# Altium schematic sheet LvlTranslate.SchDoc: Level Translators
size Letter; Author: Adam Gilbert; CompanyName: McGill University; DrawnBy: Adam Gilbert; Organization: Altium Limited; Address1: McGill Cosmology; Address2: 3600 University Street; Address3: Montreal, Quebec; Address4: Canada; Revision: Rev0; ProjectTitle: Dan DfMux Mezz; ModelNumber: MGMEZZ04; ProjectName: Dan DfMux Mezz
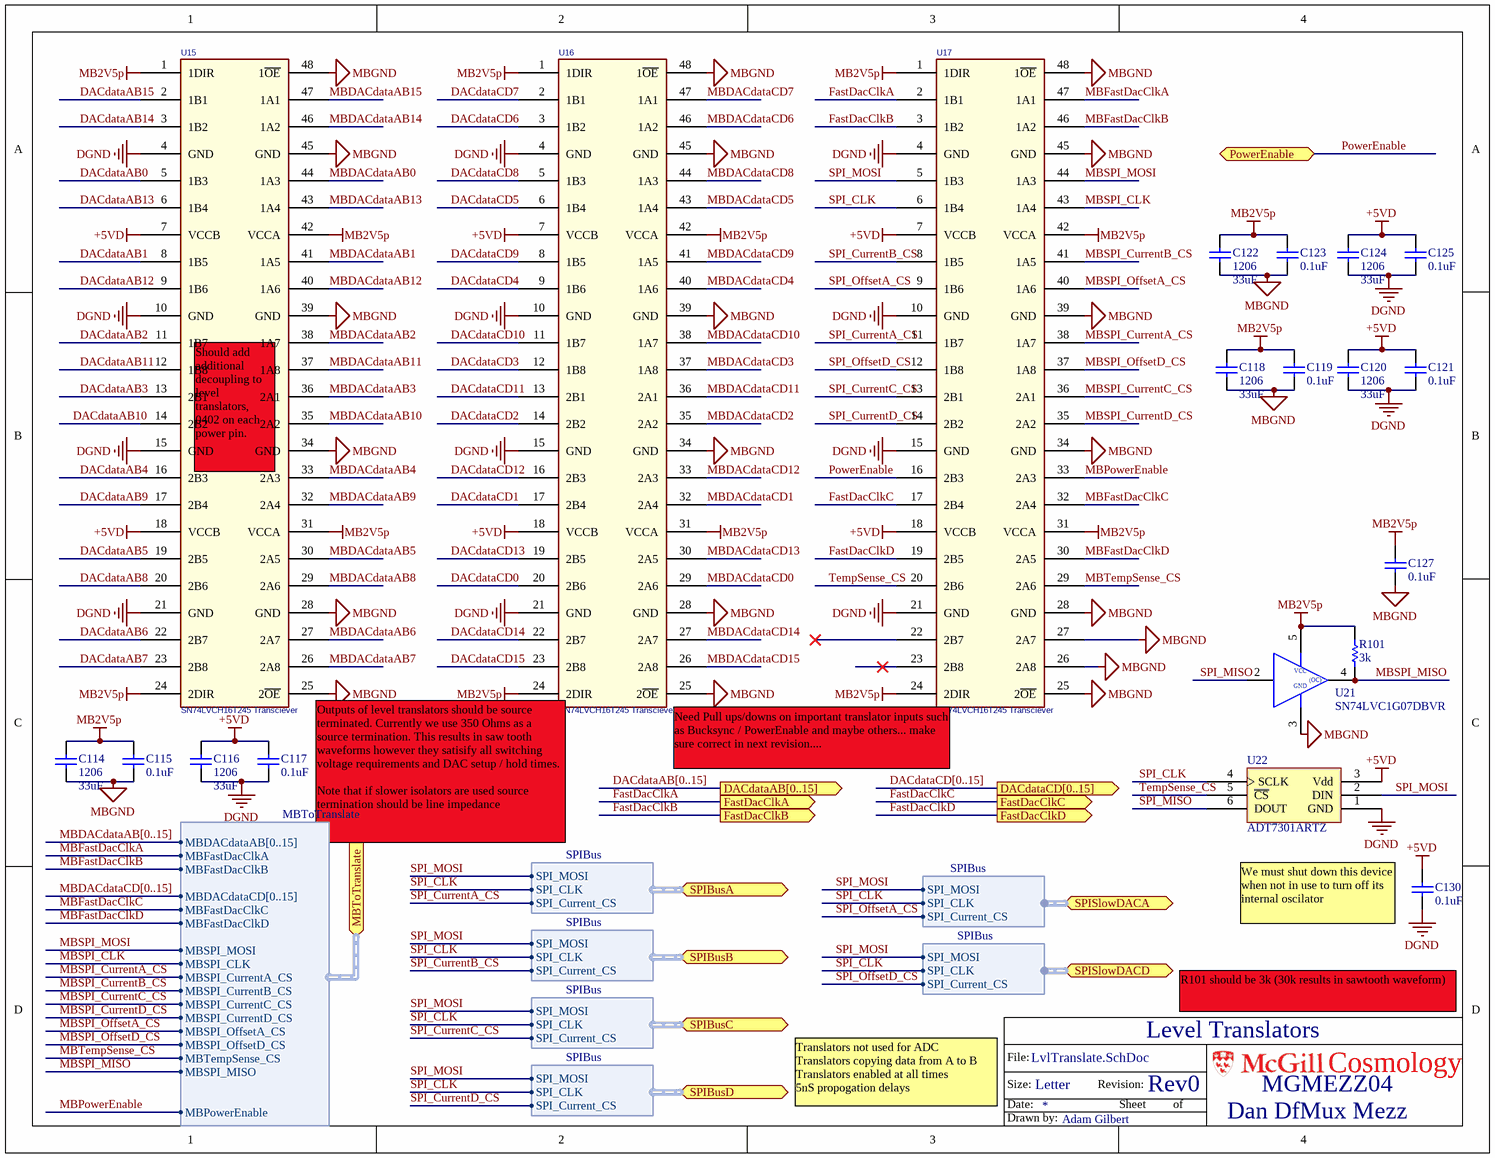
[diagram p0: LvlTranslate.SchDoc]

## Parts
C114  Footprint: 1206  [CC3225-1210]  (hidden comment: 33uF)
C115  0.1uF  [0603]
C116  Footprint: 1206  [CC3225-1210]  (hidden comment: 33uF)
C117  0.1uF  [0603]
C118  Footprint: 1206  [CC3225-1210]  (hidden comment: 33uF)
C119  0.1uF  [0603]
C120  Footprint: 1206  [CC3225-1210]  (hidden comment: 33uF)
C121  0.1uF  [0603]
C122  Footprint: 1206  [CC3225-1210]  (hidden comment: 33uF)
C123  0.1uF  [0603]
C124  Footprint: 1206  [CC3225-1210]  (hidden comment: 33uF)
C125  0.1uF  [0603]
C127  0.1uF  [0603]
C130  0.1uF  [0603]
R101  3k  [0603]
U15  SN74LVCH16T245 Transciever  [TSSOP48-0.5mmpitch]
U16  SN74LVCH16T245 Transciever  [TSSOP48-0.5mmpitch]
U17  SN74LVCH16T245 Transciever  [TSSOP48-0.5mmpitch]
U21  Manufacturers Part Number: SN74LVC1G07DBVR  [SOT23-5]  (hidden comment: 74LVC1G07)
U22  ADT7301ARTZ  [SOT23-6]

## Ports
DACdataAB[0..15] (out), DACdataCD[0..15] (out), FastDacClkA (out), FastDacClkB (out), FastDacClkC (out), FastDacClkD (out), MBToTranslate (harness MBToTranslate), PowerEnable, SPIBusA (harness SPIBus), SPIBusB (harness SPIBus), SPIBusC (harness SPIBus), SPIBusD (harness SPIBus), SPISlowDACA (harness SPIBus), SPISlowDACD (harness SPIBus)

## Harnesses
MBToTranslate: MBDACdataAB[0..15], MBFastDacClkA, MBSPI_MOSI, MBSPI_CLK, MBFastDacClkB, MBFastDacClkC, MBFastDacClkD, MBDACdataCD[0..15], MBPowerEnable, MBSPI_CurrentA_CS, MBSPI_CurrentB_CS, MBSPI_CurrentC_CS, MBSPI_CurrentD_CS, MBSPI_OffsetA_CS, MBSPI_OffsetD_CS, MBTempSense_CS, MBSPI_MISO
SPIBus: SPI_MOSI, SPI_CLK, SPI_Current_CS

## Nets
+5VD: C116.1 C117.1 C120.1 C121.1 C124.1 C125.1 C130.1 U15.7(VCCB) U15.18(VCCB) U16.7(VCCB) U16.18(VCCB) U17.7(VCCB) U17.18(VCCB) U22.3(Vdd)
DGND: C116.2 C117.2 C120.2 C121.2 C124.2 C125.2 C130.2 U15.4(GND) U15.10(GND) U15.15(GND) U15.21(GND) U16.4(GND) U16.10(GND) U16.15(GND) U16.21(GND) U17.4(GND) U17.10(GND) U17.15(GND) U17.21(GND) U22.1(GND)
MB2V5p: C114.1 C115.1 C118.1 C119.1 C122.1 C123.1 C127.1 R101.2 U15.1(1DIR) U15.24(2DIR) U15.31(VCCA) U15.42(VCCA) U16.1(1DIR) U16.24(2DIR) U16.31(VCCA) U16.42(VCCA) U17.1(1DIR) U17.24(2DIR) U17.31(VCCA) U17.42(VCCA) U21.5(Vcc)
MBGND: C114.2 C115.2 C118.2 C119.2 C122.2 C123.2 C127.2 U15.25(2~{OE}) U15.28(GND) U15.34(GND) U15.39(GND) U15.45(GND) U15.48(1~{OE}) U16.25(2~{OE}) U16.28(GND) U16.34(GND) U16.39(GND) U16.45(GND) U16.48(1~{OE}) U17.25(2~{OE}) U17.26(2A8) U17.27(2A7) U17.28(GND) U17.34(GND) U17.39(GND) U17.45(GND) U17.48(1~{OE}) U21.3(Gnd)
DACdataAB0: U15.5(1B3)
DACdataAB1: U15.8(1B5)
DACdataAB2: U15.11(1B7)
DACdataAB3: U15.13(2B1)
DACdataAB4: U15.16(2B3)
DACdataAB5: U15.19(2B5)
DACdataAB6: U15.22(2B7)
DACdataAB7: U15.23(2B8)
DACdataAB8: U15.20(2B6)
DACdataAB9: U15.17(2B4)
DACdataAB10: U15.14(2B2)
DACdataAB11: U15.12(1B8)
DACdataAB12: U15.9(1B6)
DACdataAB13: U15.6(1B4)
DACdataAB14: U15.3(1B2)
DACdataAB15: U15.2(1B1)
DACdataCD0: U16.20(2B6)
DACdataCD1: U16.17(2B4)
DACdataCD2: U16.14(2B2)
DACdataCD3: U16.12(1B8)
DACdataCD4: U16.9(1B6)
DACdataCD5: U16.6(1B4)
DACdataCD6: U16.3(1B2)
DACdataCD7: U16.2(1B1)
DACdataCD8: U16.5(1B3)
DACdataCD9: U16.8(1B5)
DACdataCD10: U16.11(1B7)
DACdataCD11: U16.13(2B1)
DACdataCD12: U16.16(2B3)
DACdataCD13: U16.19(2B5)
DACdataCD14: U16.22(2B7)
DACdataCD15: U16.23(2B8)
FastDacClkA: U17.2(1B1) ; port FastDacClkA
FastDacClkB: U17.3(1B2) ; port FastDacClkB
FastDacClkC: U17.17(2B4) ; port FastDacClkC
FastDacClkD: U17.19(2B5) ; port FastDacClkD
MBDACdataAB0: U15.44(1A3)
MBDACdataAB1: U15.41(1A5)
MBDACdataAB2: U15.38(1A7)
MBDACdataAB3: U15.36(2A1)
MBDACdataAB4: U15.33(2A3)
MBDACdataAB5: U15.30(2A5)
MBDACdataAB6: U15.27(2A7)
MBDACdataAB7: U15.26(2A8)
MBDACdataAB8: U15.29(2A6)
MBDACdataAB9: U15.32(2A4)
MBDACdataAB10: U15.35(2A2)
MBDACdataAB11: U15.37(1A8)
MBDACdataAB12: U15.40(1A6)
MBDACdataAB13: U15.43(1A4)
MBDACdataAB14: U15.46(1A2)
MBDACdataAB15: U15.47(1A1)
MBDACdataCD0: U16.29(2A6)
MBDACdataCD1: U16.32(2A4)
MBDACdataCD2: U16.35(2A2)
MBDACdataCD3: U16.37(1A8)
MBDACdataCD4: U16.40(1A6)
MBDACdataCD5: U16.43(1A4)
MBDACdataCD6: U16.46(1A2)
MBDACdataCD7: U16.47(1A1)
MBDACdataCD8: U16.44(1A3)
MBDACdataCD9: U16.41(1A5)
MBDACdataCD10: U16.38(1A7)
MBDACdataCD11: U16.36(2A1)
MBDACdataCD12: U16.33(2A3)
MBDACdataCD13: U16.30(2A5)
MBDACdataCD14: U16.27(2A7)
MBDACdataCD15: U16.26(2A8)
MBFastDacClkA: U17.47(1A1) ; port MBToTranslate.MBFastDacClkA
MBFastDacClkB: U17.46(1A2) ; port MBToTranslate.MBFastDacClkB
MBFastDacClkC: U17.32(2A4) ; port MBToTranslate.MBFastDacClkC
MBFastDacClkD: U17.30(2A5) ; port MBToTranslate.MBFastDacClkD
MBPowerEnable: U17.33(2A3) ; port MBToTranslate.MBPowerEnable
MBSPI_CLK: U17.43(1A4) ; port MBToTranslate.MBSPI_CLK
MBSPI_CurrentA_CS: U17.38(1A7) ; port MBToTranslate.MBSPI_CurrentA_CS
MBSPI_CurrentB_CS: U17.41(1A5) ; port MBToTranslate.MBSPI_CurrentB_CS
MBSPI_CurrentC_CS: U17.36(2A1) ; port MBToTranslate.MBSPI_CurrentC_CS
MBSPI_CurrentD_CS: U17.35(2A2) ; port MBToTranslate.MBSPI_CurrentD_CS
MBSPI_MISO: R101.1 U21.4(Y) ; port MBToTranslate.MBSPI_MISO
MBSPI_MOSI: U17.44(1A3) ; port MBToTranslate.MBSPI_MOSI
MBSPI_OffsetA_CS: U17.40(1A6) ; port MBToTranslate.MBSPI_OffsetA_CS
MBSPI_OffsetD_CS: U17.37(1A8) ; port MBToTranslate.MBSPI_OffsetD_CS
MBTempSense_CS: U17.29(2A6) ; port MBToTranslate.MBTempSense_CS
PowerEnable: U17.16(2B3) ; port PowerEnable
SPI_CLK: U17.6(1B4) U22.4(SCLK) ; port SPIBusA.SPI_CLK, port SPISlowDACA.SPI_CLK, port SPISlowDACD.SPI_CLK, port SPIBusB.SPI_CLK, port SPIBusC.SPI_CLK, port SPIBusD.SPI_CLK
SPI_CurrentA_CS: U17.11(1B7) ; port SPIBusA.SPI_Current_CS
SPI_CurrentB_CS: U17.8(1B5) ; port SPIBusB.SPI_Current_CS
SPI_CurrentC_CS: U17.13(2B1) ; port SPIBusC.SPI_Current_CS
SPI_CurrentD_CS: U17.14(2B2) ; port SPIBusD.SPI_Current_CS
SPI_MISO: U21.2(A) U22.6(DOUT)
SPI_MOSI: U17.5(1B3) U22.2(DIN) ; port SPIBusA.SPI_MOSI, port SPISlowDACA.SPI_MOSI, port SPISlowDACD.SPI_MOSI, port SPIBusB.SPI_MOSI, port SPIBusC.SPI_MOSI, port SPIBusD.SPI_MOSI
SPI_OffsetA_CS: U17.9(1B6) ; port SPISlowDACA.SPI_Current_CS
SPI_OffsetD_CS: U17.12(1B8) ; port SPISlowDACD.SPI_Current_CS
TempSense_CS: U17.20(2B6) U22.5(~{CS})

Not connected (* = marked no-connect by the designer): U17 22(2B7)* 23(2B8)*

## Buses and harness runs
bus DACdataAB[0..15] = port DACdataAB[0..15]
bus DACdataCD[0..15] = port DACdataCD[0..15]
bus MBDACdataAB[0..15]
bus MBDACdataCD[0..15]

## Notes on the sheet
- (near U15) Should add additional decoupling to level translators, 0402 on each power pin.
- Need Pull ups/downs on important translator inputs such as Bucksync / PowerEnable and maybe others... make sure correct in next revision....
- (near U16) Outputs of level translators should be source terminated. Currently we use 350 Ohms as a source termination. This results in saw tooth waveforms however they satisify all switching voltage requirements and DAC setup / hold times.
  Note that if slower isolators are used source termination should be line impedance
- (near C130) We must shut down this device when not in use to turn off its internal oscilator
- R101 should be 3k (30k results in sawtooth waveform)
- Translators not used for ADC
  Translators copying data from A to B
  Translators enabled at all times
  5nS propogation delays
- File:
- Size:
- Date:
- Letter
- Revision:
- Sheet
- of
- Cosmology
- Drawn by:
- (in symbol 74LVC1G07) VCC; (OC); GND

## Library data of the parts
C114 C116 C118 C120 C122 C124 = CAP 1210: Capacitor, Ceramic, 1210; Manufacturer: TDK Corporation; Part Constraints: 33uF or 47uF  (1206 or 1210) 25V X5R; Manufacturers Part Number: C3216X5R1E336M; Assembly Comments: none; Type: Capacitor; SupplierUnitCost: $1.1; Value: 33uF; Supplier 1: Digi-Key; Supplier Part Number 1: 445-8046-1-ND
C115 C117 C119 C121 C123 C125 C127 C130 = CAP 0603: Capacitor, Ceramic, 0603; Part Constraints: 10% 16V X7R 0603; Manufacturer: Generic; Manufacturers Part Number: Generic; Value: 0.1uF; Type: Capacitor; SupplierUnitCost: 0
R101 = RES 0603: Resistor; Manufacturer: Generic; Part Constraints: 1% 1/10W 100ppm 0603; Assembly Comments: none; Manufacturers Part Number: Generic; Type: Resistor; SupplierUnitCost: 0; Value: 3k
U15-U17 = SN74LVCH16T245 Transciever: Manufacturer: Texas Instruments; Assembly Comments: none; Part Constraints: SN74LVCH16T245; Manufacturers Part Number: SN74LVCH16T245; Type: IC; Supplier 1: Digi-Key; Supplier Part Number 1: 296-27606-6-ND
U21 = 74LVC1G07: Single  NON-INVERTING BUFFER, Open Drain; Manufacturer: Texas Instruments; Assembly Comments: none; Part Constraints: SN74LVC1G07DBVR; SupplierUnitCost: $0.09; Type: IC; Supplier 1: Digi-Key; Supplier Part Number 1: 296-8485-1-ND
U22 = ADT7301: Digital Temperature Sensor, 13-Bit, +/-1 Degree Accurate; Manufacturer: Analog Devices; CanPurchaseFrom: Digikey; Footprint: *; TechInfo: *; Manufacturers Part Number: ADT7301ARTZ; Part constraints: ADT7301ARTZ